# Altium schematic sheet Sheet1.SchDoc
size 420 x 297 mm; CheckedBy: Бондурчук ПС; Author: Ільницька ЛЛ; CompanyName: ТОВ "Радіонікс"; SheetNumber: 1; SheetTotal: 4; DecimalNumber: АЧАД.468224.ххх Э3; HeadOfSector: Нач. сектора; MainDevice: Перв.примен.; Name: Контролер управління; DecimalNumber_MIRROR: ххх.22864.ДАЧА; ЕСКД_Децимальний_номер: АЧАД.468224.ххх Э3; ЕСКД_Назва_схеми_1: Схема електрична; ЕСКД_Назва_схеми_2: принципова; ЕСКД_Лист: 1; ЕСКД_Листів: 4; ЕСКД_Назва_пристрою_1: Система контроля; ЕСКД_Назва_пристрою_2: АСК-2; ЕСКД_Організація: ТОВ "Радіонікс"; PageSetup: Record=PageOptions|CenterHorizontal=True|CenterVertical=True|PrintScale=0.98|XCorrection=1.00|YCorrection=1.00|PrintKind=1|BorderSize=5000000|LeftOffset=0|BottomOffset=0|Orientation=2|PaperLength=1000|PaperWidth=1000|Scale=100|PaperSource=15|PrintQuality=1200|MediaType=1|DitherType=10|PrintScaleMode=1|PaperKind=A3|PaperIndex=8
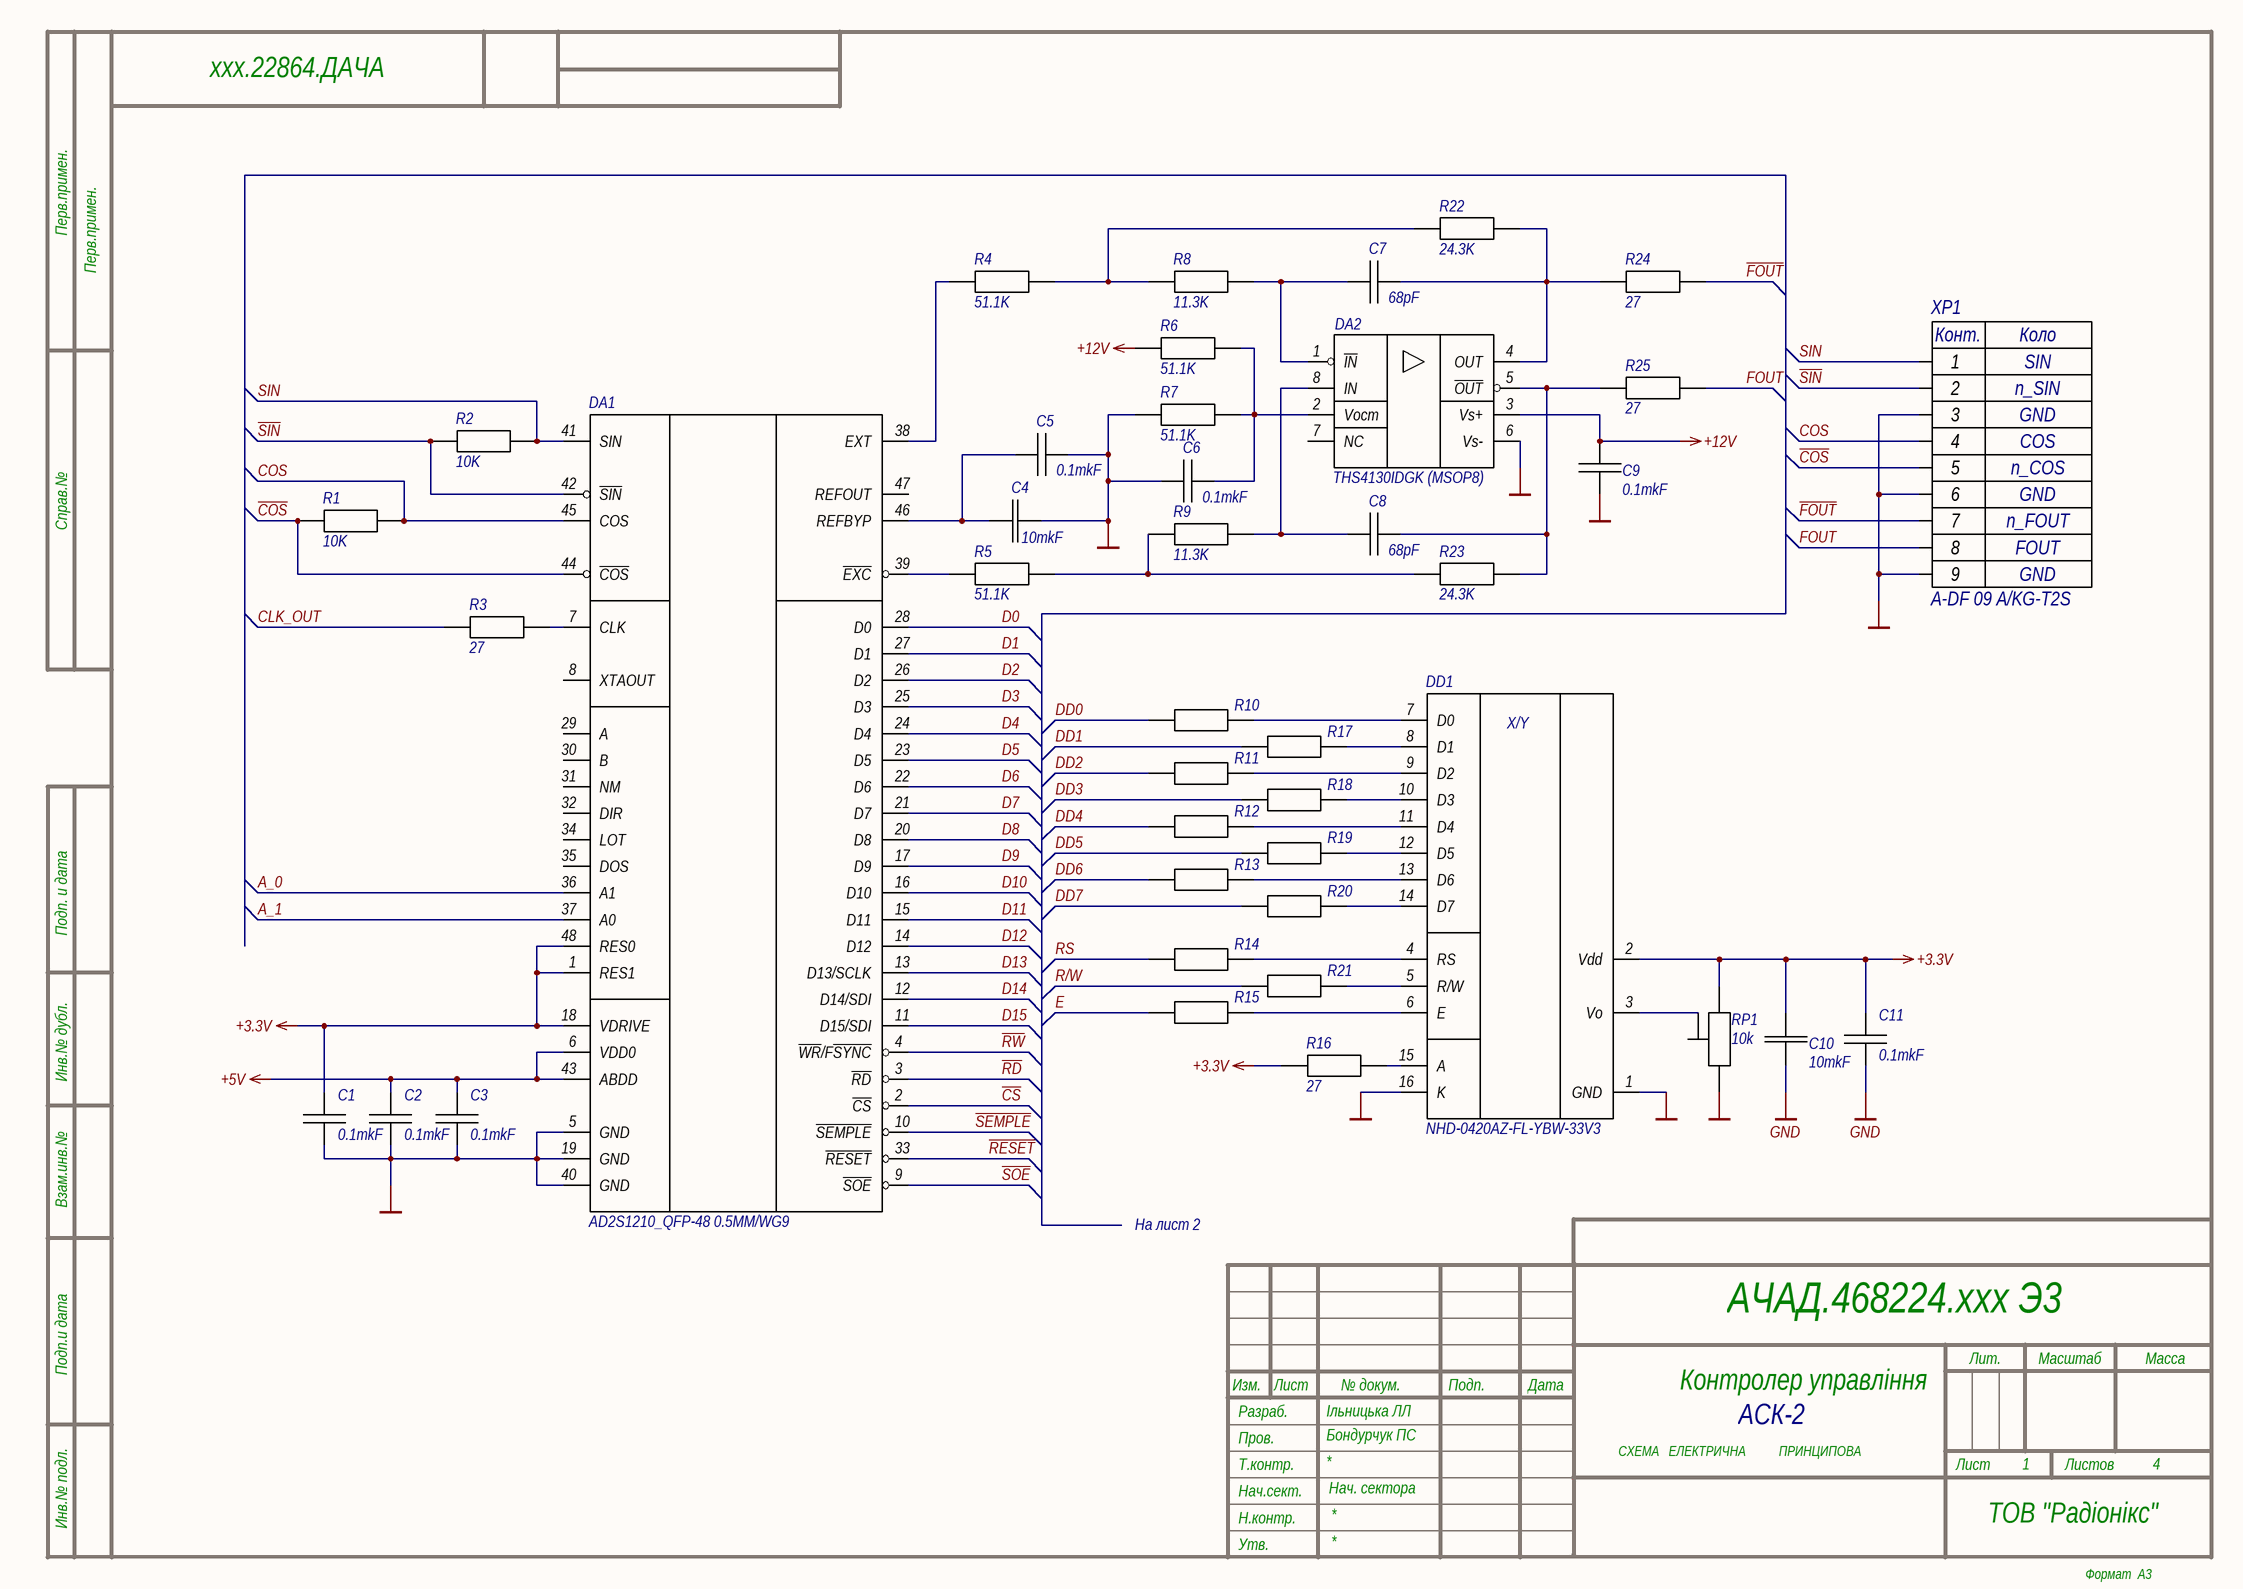
[diagram p0: Sheet1.SchDoc]

## Parts
C1  0.1mkF  [C_0603]
C2  0.1mkF  [C_0603]
C3  0.1mkF  [C_0603]
C4  10mkF  [C_1206]
C5  0.1mkF  [C_0603]
C6  0.1mkF  [C_0603]
C7  68pF  [C_0603]
C8  68pF  [C_0603]
C9  0.1mkF  [C_0603]
C10  10mkF  [C_1206]
C11  0.1mkF  [C_0603]
DA1  AD2S1210_QFP-48 0.5MM/WG9  [QFP-48 0.5MM/WG9]
DA2  THS4130IDGK (MSOP8)  [THS4130IDGK(MSOP8)]
DD1  NHD-0420AZ-FL-YBW-33V3  [NHD-0420AZ-FL-YBW-33V3-ND]
R1  10K  [R_0603]
R2  10K  [R_0603]
R3  27  [R_0603]
R4  51.1K  [R_0603]
R5  51.1K  [R_0603]
R6  51.1K  [R_0603]
R7  51.1K  [R_0603]
R8  11.3K  [R_0603]
R9  11.3K  [R_0603]
R10  27  [R_0603]  (value not drawn)
R11  27  [R_0603]  (value not drawn)
R12  27  [R_0603]  (value not drawn)
R13  27  [R_0603]  (value not drawn)
R14  27  [R_0603]  (value not drawn)
R15  27  [R_0603]  (value not drawn)
R16  27  [R_1206]
R17  27  [R_0603]  (value not drawn)
R18  27  [R_0603]  (value not drawn)
R19  27  [R_0603]  (value not drawn)
R20  27  [R_0603]  (value not drawn)
R21  27  [R_0603]  (value not drawn)
R22  24.3K  [R_0603]
R23  24.3K  [R_0603]
R24  27  [R_0603]
R25  27  [R_0603]
RP1  10k  [RES_TRIMMER_3361P-1-103GLF]
XP1  A-DF 09 A/KG-T2S

## Nets
+3.3V: C1.2 C10.2 C11.2 DA1.1(RES1) DA1.18(VDRIVE) DA1.48(RES0) DD1.2(Vdd) R16.1 RP1.2
+5V: C2.2 C3.2 DA1.6(VDD0) DA1.43(ABDD)
+12V: C9.1 DA2.3(Vs+) R6.1
GND: C1.1 C2.1 C3.1 C4.2 C5.1 C6.2 C9.2 C10.1 C11.1 DA1.5(GND) DA1.19(GND) DA1.40(GND) DA2.6(Vs-) DD1.1(GND) DD1.16(K) R7.1 RP1.1 XP1.3 XP1.6 XP1.9
A_0: DA1.36(A1)
A_1: DA1.37(A0)
~{COS}: DA1.44(~{COS}) R1.2 XP1.5
~{CS}: DA1.2(~{CS})
CLK_OUT: R3.1
COS: DA1.45(COS) R1.1 XP1.4
D0: DA1.28(D0)
D1: DA1.27(D1)
D2: DA1.26(D2)
D3: DA1.25(D3)
D4: DA1.24(D4)
D5: DA1.23(D5)
D6: DA1.22(D6)
D7: DA1.21(D7)
D8: DA1.20(D8)
D9: DA1.17(D9)
D10: DA1.16(D10)
D11: DA1.15(D11)
D12: DA1.14(D12)
D13: DA1.13(D13/SCLK)
D14: DA1.12(D14/SDI)
D15: DA1.11(D15/SDI)
DD0: R10.1
DD1: R17.1
DD2: R11.1
DD3: R18.1
DD4: R12.1
DD5: R19.1
DD6: R13.1
DD7: R20.1
E: R15.1
~{FOUT}: R24.2 XP1.7
FOUT: R25.2 XP1.8
R/W: R21.1
~{RD}: DA1.3(~{RD})
~{RESET}: DA1.33(~{RESET})
~{RW}: DA1.4(~{WR}/F~{SYNC})
RS: R14.1
~{SEMPLE}: DA1.10(~{SEMPLE})
~{SIN}: DA1.42(~{SIN}) R2.1 XP1.2
~{SOE}: DA1.9(~{SOE})
SIN: DA1.41(SIN) R2.2 XP1.1
NetC4_1: C4.1 C5.2 DA1.46(REFBYP)
NetC6_1: C6.1 DA2.2(Vocm) R6.2 R7.2
NetC7_1: C7.1 DA2.4(OUT) R22.2 R24.1
NetC7_2: C7.2 DA2.1(~{IN}) R8.2
NetC8_1: C8.1 DA2.5(~{OUT}) R23.1 R25.1
NetC8_2: C8.2 DA2.8(IN) R9.2
NetDA1_7: DA1.7(CLK) R3.2
NetDA1_38: DA1.38(EXT) R4.1
NetDA1_39: DA1.39(~{EXC}) R5.1
NetDD1_3: DD1.3(Vo) RP1.3
NetDD1_4: DD1.4(RS) R14.2
NetDD1_5: DD1.5(R/W) R21.2
NetDD1_6: DD1.6(E) R15.2
NetDD1_7: DD1.7(D0) R10.2
NetDD1_8: DD1.8(D1) R17.2
NetDD1_9: DD1.9(D2) R11.2
NetDD1_10: DD1.10(D3) R18.2
NetDD1_11: DD1.11(D4) R12.2
NetDD1_12: DD1.12(D5) R19.2
NetDD1_13: DD1.13(D6) R13.2
NetDD1_14: DD1.14(D7) R20.2
NetDD1_15: DD1.15(A) R16.2
NetR4_2: R4.2 R8.1 R22.1
NetR5_2: R5.2 R9.1 R23.2

Not connected (* = marked no-connect by the designer): DA1 8(XTAOUT) 29(A) 30(B) 31(NM) 32(DIR) 34(LOT) 35(DOS) 47(REFOUT); DA2 7(NC)

## Notes on the sheet
- SIN
- n_SIN
- COS
- n_COS
- GND
- n_FOUT
- FOUT
- На лист 2
- АСК-2
- Перв.примен.
- Справ.№
- Подп. и дата
- Инв.№ дубл.
- Взам.инв.№
- Подп.и дата
- Разраб.
- Изм.
- Лист
- № докум.
- Подп.
- Дата
- Лит.
- Масштаб
- Масса
- Т.контр.
- Пров.
- СХЕМА   ЕЛЕКТРИЧНА
- ПРИНЦИПОВА
- Листов
- Инв.№ подл.
- Утв.
- Н.контр.
- Нач.сект.
- Формат  A3
- (in symbol A-DF 09 A/KG-T2S) Конт.; Коло
- (in symbol NHD-0420AZ-FL-YBW-33V3) X/Y

## Library data of the parts
C1-C3 C5-C9 C11 = C_0.1mkF_0603
  C1-C3 C5 C6 C9 C11: Value: 0.1mkF
  C7 C8: Value: 68pF
C4 C10 = C_10mkF_1206: Value: 10mkF
R1-R15 R17-R25 = R_100_0603
  R1 R2: Value: 10K
  R3 R10-R15 R17-R21 R24 R25: Value: 27
  R4-R7: Value: 51.1K
  R8 R9: Value: 11.3K
  R22 R23: Value: 24.3K
R16 = R_10_1206: Value: 27
RP1 = R_10k_RES_TRIMMER: R_10k_RES_TRIMMER_3361P-1-103GLF; Value: 10k
DA1 = AD2S1210_QFP-48 0.5MM/WG9: Case: QFP-48 0.5MM/WG9